# Altium schematic sheet Cover.SchDoc
size A3; DocumentNumber: 1; Revision: 30.09.2024 (V1.0); SheetNumber: 1; SheetTotal: 4; ProjectDescription: I2C Shield; preparedBy: Aslı Kurt; ReleaseDate: 30.09.2024; SheetSize: A3
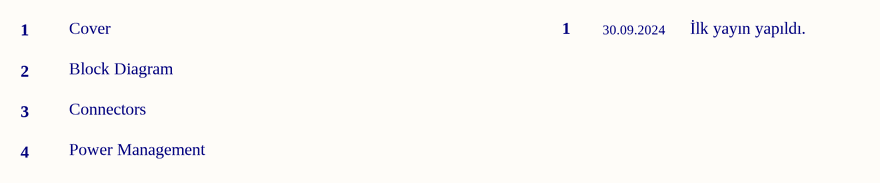
[diagram p0: Cover.SchDoc]

## Notes on the sheet
- 2
- 1
- Cover
- Block Diagram
- 30.09.2024
- İlk yayın yapıldı.
- 3
- 4
- Connectors
- Power Management
- İÇİNDEKİLER / CONTENTS
- REVİZYON / REVISION
- ÜRETİM NOTLARI / PRODUCTION NOTES
- Sayfa Nu.
- Page No
- Açıklama / Description
- Tarih
- Date
- Board Features
- Kart Özellikleri
- Üretim Çıktıları
- Gerber Files
- Ekler
- Attachments
- İLETİŞİM / CONTACT
- DOSYA ADI / FILE NAME
- TANIM / DESCRIPTION
- HAZIRLAYAN / PREPARED BY
- YAYIN TARİHİ / REL. DATE
- BOYUT / SIZE
- SAYFA / SHEET
- /